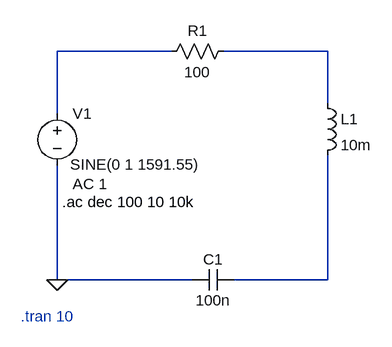
[diagram p0: schematic project.asc]
project.asc, the LTspice schematic file:
Version 4.1
SHEET 1 880 680
WIRE 192 48 16 48
WIRE 432 48 272 48
WIRE 432 128 432 48
WIRE 16 144 16 48
WIRE 16 400 16 224
WIRE 224 400 16 400
WIRE 432 400 432 208
WIRE 432 400 288 400
FLAG 16 400 0
SYMBOL voltage 16 128 R0
WINDOW 3 20 94 Left 2
WINDOW 123 24 124 Left 2
WINDOW 39 0 0 Left 0
SYMATTR Value SINE(0 1 1591.55)
SYMATTR Value2 AC 1
SYMATTR InstName V1
SYMBOL res 288 32 R90
WINDOW 0 0 56 VBottom 2
WINDOW 3 32 56 VTop 2
SYMATTR InstName R1
SYMATTR Value 100
SYMBOL ind 416 112 R0
SYMATTR InstName L1
SYMATTR Value 10m
SYMBOL cap 288 384 R90
WINDOW 0 0 32 VBottom 2
WINDOW 3 32 32 VTop 2
SYMATTR InstName C1
SYMATTR Value 100n
TEXT -40 456 Left 2 ;.tran 10
TEXT 24 280 Left 2 !.ac dec 100 10 10k

The netlist it stands for:
* project.asc
V1 N001 0 SINE(0 1 1591.55) AC 1
R1 N002 N001 100
L1 N002 N003 10m
C1 N003 0 100n
* .tran 10
.ac dec 100 10 10k
.backanno
.end